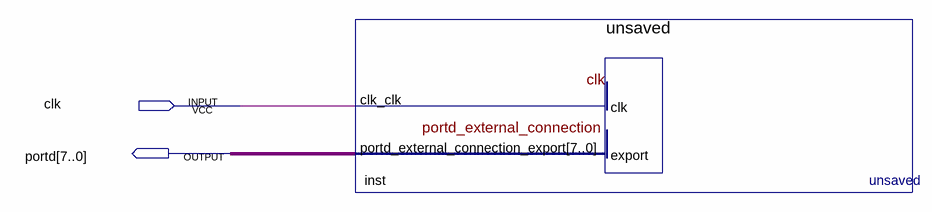
[diagram p0: schematic sheet]
// Quartus schematic hola_nios2.bdf as structural Verilog: 1 symbols, 2 pins
module hola_nios2 (
  input  clk,
  output [7:0] portd
);

  unsaved inst (.clk_clk(clk), .portd_external_connection_export(portd));
endmodule
